# Altium schematic sheet NIR.SchDoc
size A4
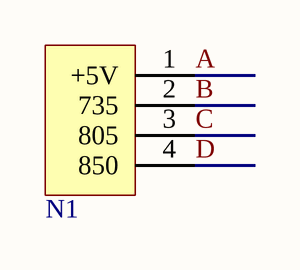
[diagram p0: NIR.SchDoc]

## Parts
N1  NIRLED  [OTP]  (value not drawn)

## Nets
A: N1.1(+5V)
B: N1.2(735)
C: N1.3(805)
D: N1.4(850)